# Altium schematic sheet 主控板Qiao.SchDoc
size A3
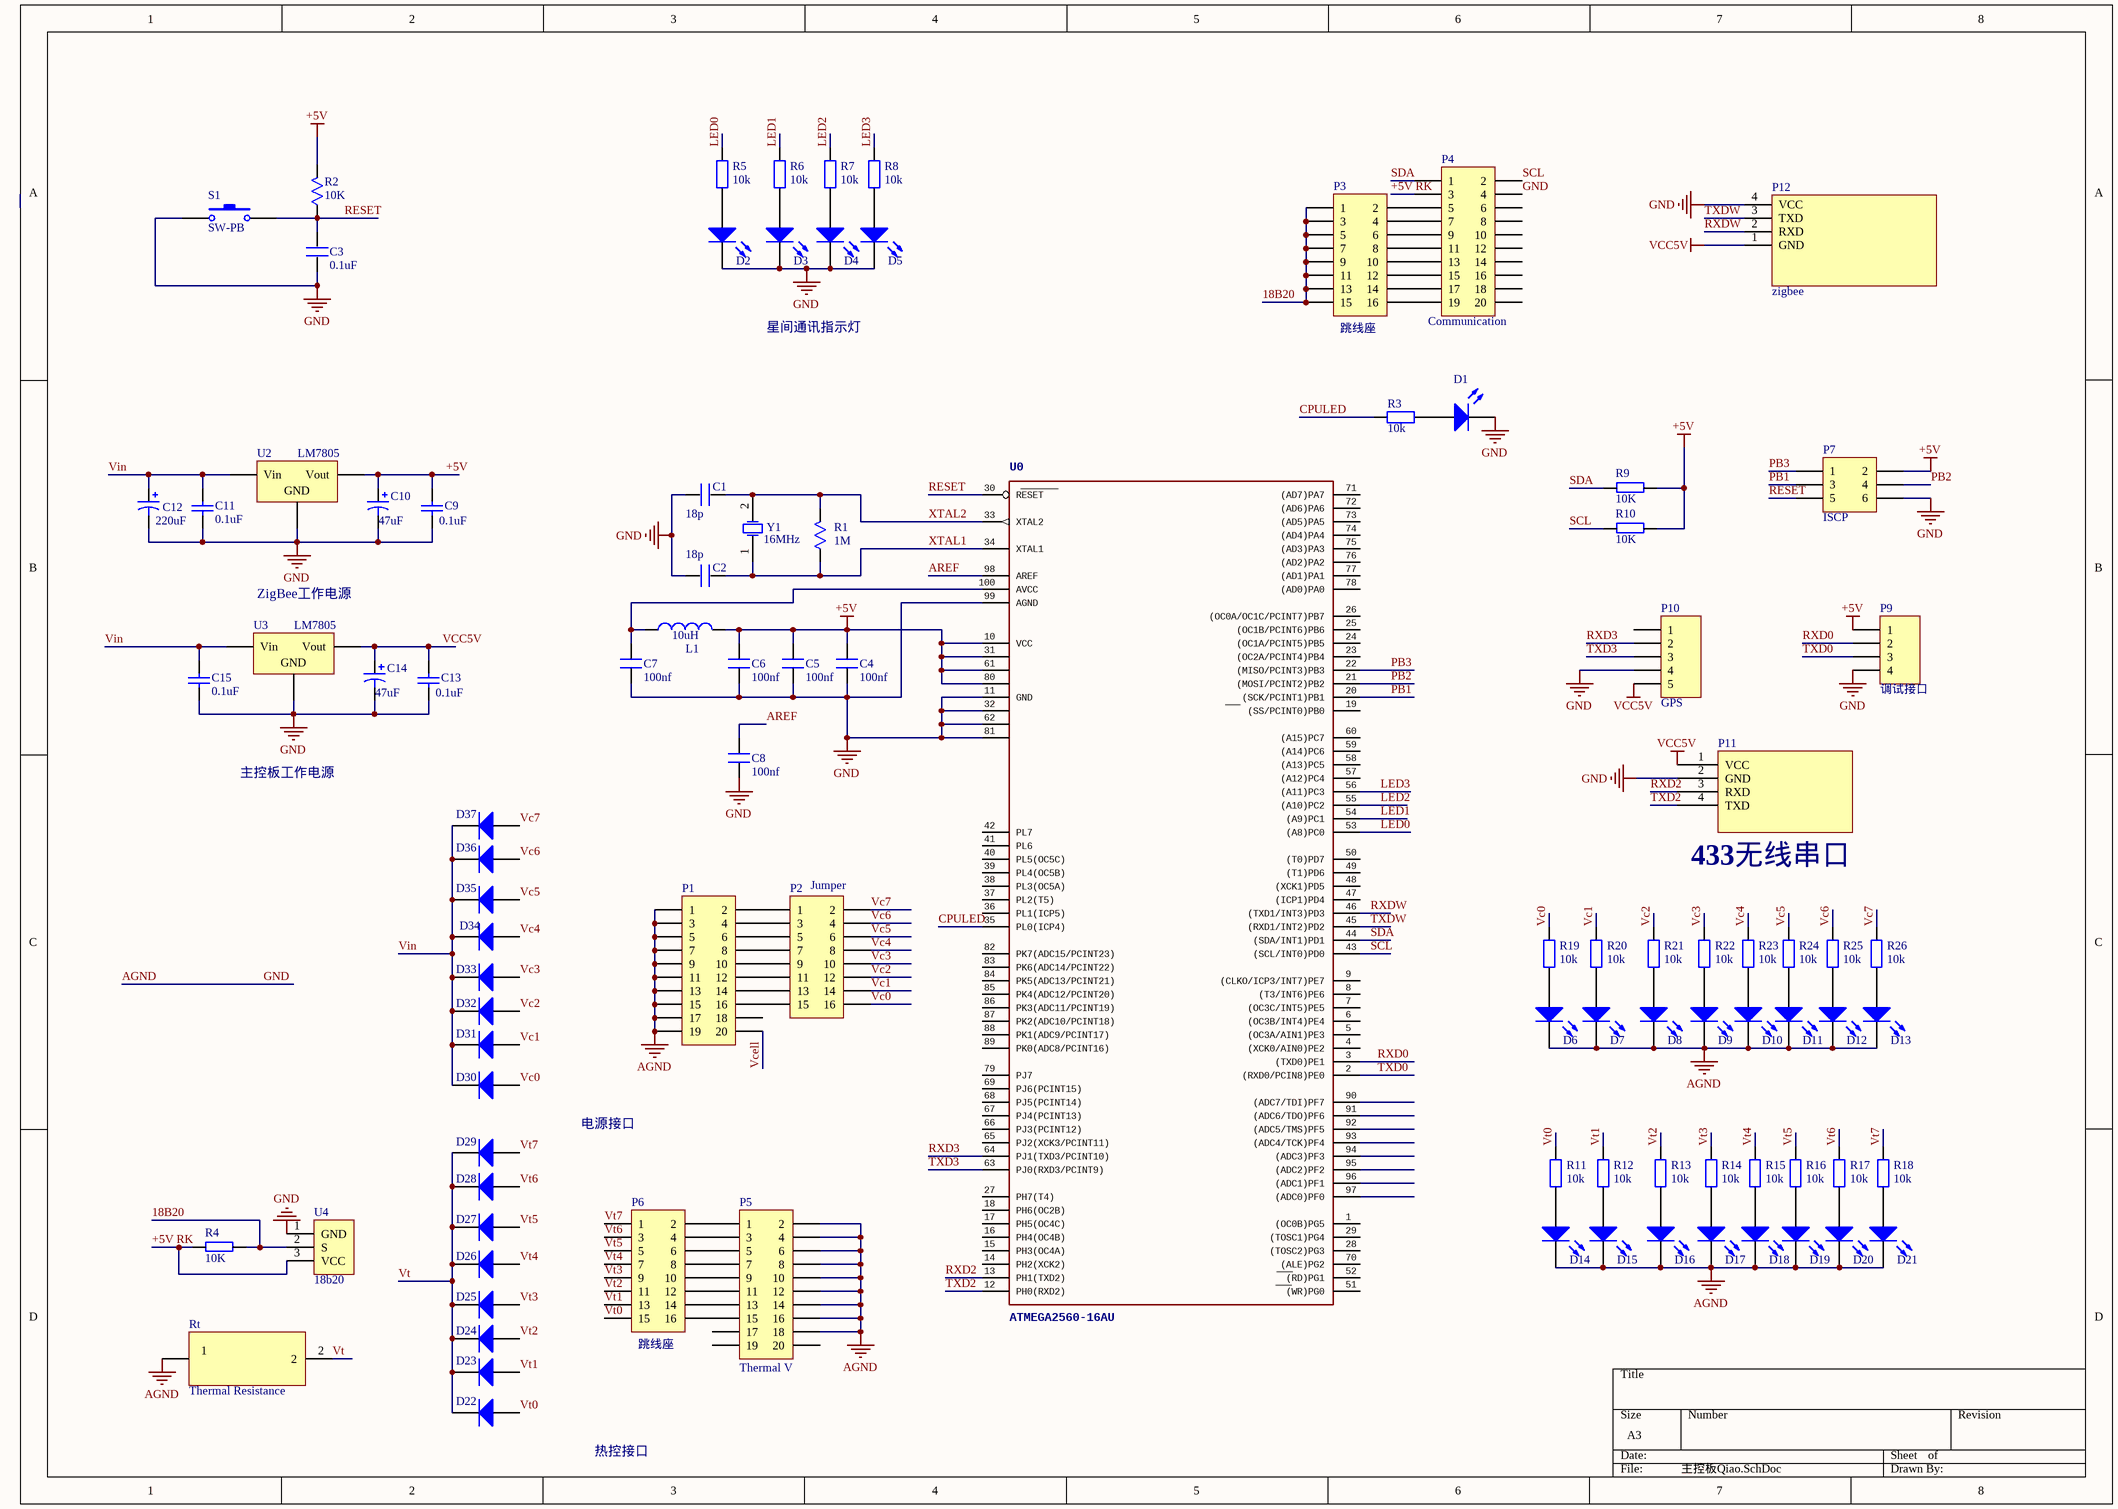
[diagram p0: 主控板Qiao.SchDoc]

## Parts
C1  18p  [CAPC3216M]
C2  18p  [CAPC3216M]
C3  0.1uF  [CAPC3216M]
C4  100nf  [CAPC3216M]
C5  100nf  [CAPC3216M]
C6  100nf  [CAPC3216M]
C7  100nf  [CAPC3216M]
C8  100nf  [CAPC3216M]
C9  0.1uf  [CAPC3216M]
C10  value 47uF  [25V47uF]  (hidden comment: 25V47uF)
C11  0.1uf  [CAPC3216M]
C12  value 220uF  [25V47uF]  (hidden comment: 50V220uF)
C13  0.1uf  [CAPC3216M]
C14  value 47uF  [25V47uF]  (hidden comment: 25V47uF)
C15  0.1uf  [CAPC3216M]
D1  LED  [DIPLED]  (value not drawn)
D2  LED  [LED]  (value not drawn)
D3  LED  [LED]  (value not drawn)
D4  LED  [LED]  (value not drawn)
D5  LED  [LED]  (value not drawn)
D6  LED  [LED]  (value not drawn)
D7  LED  [LED]  (value not drawn)
D8  LED  [LED]  (value not drawn)
D9  LED  [LED]  (value not drawn)
D10  LED  [LED]  (value not drawn)
D11  LED  [LED]  (value not drawn)
D12  LED  [LED]  (value not drawn)
D13  LED  [LED]  (value not drawn)
D14  LED  [LED]  (value not drawn)
D15  LED  [LED]  (value not drawn)
D16  LED  [LED]  (value not drawn)
D17  LED  [LED]  (value not drawn)
D18  LED  [LED]  (value not drawn)
D19  LED  [LED]  (value not drawn)
D20  LED  [LED]  (value not drawn)
D21  LED  [LED]  (value not drawn)
D22  1N4001  [SMB]  (value not drawn)
D23  1N4001  [SMB]  (value not drawn)
D24  1N4001  [SMB]  (value not drawn)
D25  1N4001  [SMB]  (value not drawn)
D26  1N4001  [SMB]  (value not drawn)
D27  1N4001  [SMB]  (value not drawn)
D28  1N4001  [SMB]  (value not drawn)
D29  1N4001  [SMB]  (value not drawn)
D30  1N4001  [SMB]  (value not drawn)
D31  1N4001  [SMB]  (value not drawn)
D32  1N4001  [SMB]  (value not drawn)
D33  1N4001  [SMB]  (value not drawn)
D34  1N4001  [SMB]  (value not drawn)
D35  1N4001  [SMB]  (value not drawn)
D36  1N4001  [SMB]  (value not drawn)
D37  1N4001  [SMB]  (value not drawn)
L1  value 10uH  [CAPC3216M]  (hidden comment: Inductor)
P1  Power Interface  [HDR2X10]  (value not drawn)
P2  Jumper  [HDR2X8]
P3  跳线座  [HDR2X8]
P4  Communication  [HDR2X10]
P5  Thermal V  [HDR2X10]
P6  跳线座  [HDR2X8]
P7  ISCP  [HDR2X3]
P9  调试接口  [HDR1X4]
P10  GPS  [GPS]
P11  433无线串口  [433PCB]
P12  zigbee  [ZigBee]
R1  1M  [RESC3216M]
R2  10K  [RESC3216M]
R3  10K  [RESC3216M]
R4  10K  [RESC3216M]
R5  10K  [RESC3216M]
R6  10K  [RESC3216M]
R7  10K  [RESC3216M]
R8  10K  [RESC3216M]
R9  10K  [RESC3216M]
R10  10K  [RESC3216M]
R11  10K  [RESC3216M]
R12  10K  [RESC3216M]
R13  10K  [RESC3216M]
R14  10K  [RESC3216M]
R15  10K  [RESC3216M]
R16  10K  [RESC3216M]
R17  10K  [RESC3216M]
R18  10K  [RESC3216M]
R19  10K  [RESC3216M]
R20  10K  [RESC3216M]
R21  10K  [RESC3216M]
R22  10K  [RESC3216M]
R23  10K  [RESC3216M]
R24  10K  [RESC3216M]
R25  10K  [RESC3216M]
R26  10K  [RESC3216M]
Rt  Thermal Resistance  [Thermal Res]
S1  SW-PB  [PUSH BUTTON 6x6]
U0  ATMEGA2560-16AU  [TQFP100]
U2  LM7805  [DPAK-3]
U3  LM7805  [DPAK-3]
U4  18b20  [TO92]
Y1  16MHz  [XTAL_US]

## Nets
+5V: C4.2 C5.2 C6.2 C9.2 C10.1 L1.2 P7.2 P9.1 R2.2 R9.1 R10.1 U0.10(VCC) U0.31(VCC1) U0.61(VCC2) U0.80(VCC3) U2.3(Vout)
AGND: C1.1 C2.1 C3.1 C4.1 C5.1 C6.1 C7.1 C8.1 C9.1 C10.2 C11.1 C12.2 C13.1 C14.2 C15.1 D1.2(K) D2.2(K) D3.2(K) D4.2(K) D5.2(K) D6.2(K) D7.2(K) D8.2(K) D9.2(K) D10.2(K) D11.2(K) D12.2(K) D13.2(K) D14.2(K) D15.2(K) D16.2(K) D17.2(K) D18.2(K) D19.2(K) D20.2(K) D21.2(K) P1.1 P1.3 P1.5 P1.7 P1.9 P1.11 P1.13 P1.15 P1.17 P1.19 P4.4 P5.2 P5.4 P5.6 P5.8 P5.10 P5.12 P5.14 P5.16 P5.18 P7.6 P9.4 P10.4 P11.2(GND) P12.4(VCC) Rt.1 S1.1 U0.11(GND) U0.32(GND1) U0.62(GND2) U0.81(GND3) U0.99(AGND) U2.2(GND) U3.2(GND) U4.1(GND)  [also labelled GND]
VCC5V: C13.2 C14.1 P10.5 P11.1(VCC) P12.1(GND) U3.3(Vout)
18B20: P3.1 P3.3 P3.5 P3.7 P3.9 P3.11 P3.13 P3.15 R4.1 U4.2(S)
+5V RK: P4.3 R4.2 U4.3(VCC)
AREF: C8.2 U0.98(AREF)
CPULED: R3.2 U0.35(PL0(ICP4))
LED0: R5.2 U0.53((A8)PC0)
LED1: R6.2 U0.54((A9)PC1)
LED2: R7.2 U0.55((A10)PC2)
LED3: R8.2 U0.56((A11)PC3)
PB1: P7.3 U0.20((SCK/PCINT1)PB1)
PB2: P7.4 U0.21((MOSI/PCINT2)PB2)
PB3: P7.1 U0.22((MISO/PCINT3)PB3)
RESET: C3.2 P7.5 R2.1 S1.2 U0.30(RESET)
RXD0: P9.2 U0.3((TXD0)PE1)
RXD2: P11.3(RXD) U0.13(PH1(TXD2))
RXD3: P10.2 U0.64(PJ1(TXD3/PCINT10))
RXDW: P12.2(RXD) U0.46((TXD1/INT3)PD3)
SCL: P4.2 R10.2 U0.43((SCL/INT0)PD0)
SDA: P4.1 R9.2 U0.44((SDA/INT1)PD1)
TXD0: P9.3 U0.2((RXD0/PCIN8)PE0)
TXD2: P11.4(TXD) U0.12(PH0(RXD2))
TXD3: P10.3 U0.63(PJ0(RXD3/PCINT9))
TXDW: P12.3(TXD) U0.45((RXD1/INT2)PD2)
Vc0: D30.1(A) P2.16 R19.2
Vc1: D31.1(A) P2.14 R20.2
Vc2: D32.1(A) P2.12 R21.2
Vc3: D33.1(A) P2.10 R22.2
Vc4: D34.1(A) P2.8 R23.2
Vc5: D35.1(A) P2.6 R24.2
Vc6: D36.1(A) P2.4 R25.2
Vc7: D37.1(A) P2.2 R26.2
Vcell: P1.20
Vin: C11.2 C12.1 C15.2 D30.2(K) D31.2(K) D32.2(K) D33.2(K) D34.2(K) D35.2(K) D36.2(K) D37.2(K) U2.1(Vin) U3.1(Vin)
Vt: D22.2(K) D23.2(K) D24.2(K) D25.2(K) D26.2(K) D27.2(K) D28.2(K) D29.2(K) Rt.2
Vt0: D22.1(A) P6.15 R11.2
Vt1: D23.1(A) P6.13 R12.2
Vt2: D24.1(A) P6.11 R13.2
Vt3: D25.1(A) P6.9 R14.2
Vt4: D26.1(A) P6.7 R15.2
Vt5: D27.1(A) P6.5 R16.2
Vt6: D28.1(A) P6.3 R17.2
Vt7: D29.1(A) P6.1 R18.2
XTAL1: C2.2 R1.1 U0.34(XTAL1) Y1.1(OSC1)
XTAL2: C1.2 R1.2 U0.33(XTAL2) Y1.2(OSC2)
NetC7_2: C7.2 L1.1 U0.100(AVCC)
NetD1_1: D1.1(A) R3.1
NetD2_1: D2.1(A) R5.1
NetD3_1: D3.1(A) R6.1
NetD4_1: D4.1(A) R7.1
NetD5_1: D5.1(A) R8.1
NetD6_1: D6.1(A) R19.1
NetD7_1: D7.1(A) R20.1
NetD8_1: D8.1(A) R21.1
NetD9_1: D9.1(A) R22.1
NetD10_1: D10.1(A) R23.1
NetD11_1: D11.1(A) R24.1
NetD12_1: D12.1(A) R25.1
NetD13_1: D13.1(A) R26.1
NetD14_1: D14.1(A) R11.1
NetD15_1: D15.1(A) R12.1
NetD16_1: D16.1(A) R13.1
NetD17_1: D17.1(A) R14.1
NetD18_1: D18.1(A) R15.1
NetD19_1: D19.1(A) R16.1
NetD20_1: D20.1(A) R17.1
NetD21_1: D21.1(A) R18.1
NetP1_2: P1.2 P2.1
NetP1_4: P1.4 P2.3
NetP1_6: P1.6 P2.5
NetP1_8: P1.8 P2.7
NetP1_10: P1.10 P2.9
NetP1_12: P1.12 P2.11
NetP1_14: P1.14 P2.13
NetP1_16: P1.16 P2.15
NetP3_2: P3.2 P4.5
NetP3_4: P3.4 P4.7
NetP3_6: P3.6 P4.9
NetP3_8: P3.8 P4.11
NetP3_10: P3.10 P4.13
NetP3_12: P3.12 P4.15
NetP3_14: P3.14 P4.17
NetP3_16: P3.16 P4.19
NetP5_1: P5.1 P6.2
NetP5_3: P5.3 P6.4
NetP5_5: P5.5 P6.6
NetP5_7: P5.7 P6.8
NetP5_9: P5.9 P6.10
NetP5_11: P5.11 P6.12
NetP5_13: P5.13 P6.14
NetP5_15: P5.15 P6.16

Not connected (* = marked no-connect by the designer): P1 18; P4 6 8 10 12 14 16 18 20; P5 17 19 20; P10 1; U0 1((OC0B)PG5) 4((XCK0/AIN0)PE2) 5((OC3A/AIN1)PE3) 6((OC3B/INT4)PE4) 7((OC3C/INT5)PE5) 8((T3/INT6)PE6) 9((CLKO/ICP3/INT7)PE7) 14(PH2(XCK2)) 15(PH3(OC4A)) 16(PH4(OC4B)) 17(PH5(OC4C)) 18(PH6(OC2B)) 19((SS/PCINT0)PB0) 23((OC2A/PCINT4)PB4) 24((OC1A/PCINT5)PB5) 25((OC1B/PCINT6)PB6) 26((OC0A/OC1C/PCINT7)PB7) 27(PH7(T4)) 28((TOSC2)PG3) 29((TOSC1)PG4) 36(PL1(ICP5)) 37(PL2(T5)) 38(PL3(OC5A)) 39(PL4(OC5B)) 40(PL5(OC5C)) 41(PL6) 42(PL7) 47((ICP1)PD4) 48((XCK1)PD5) 49((T1)PD6) 50((T0)PD7) 51((WR)PG0) 52((RD)PG1) 57((A12)PC4) 58((A13)PC5) 59((A14)PC6) 60((A15)PC7) 65(PJ2(XCK3/PCINT11)) 66(PJ3(PCINT12)) 67(PJ4(PCINT13)) 68(PJ5(PCINT14)) 69(PJ6(PCINT15)) 70((ALE)PG2) 71((AD7)PA7) 72((AD6)PA6) 73((AD5)PA5) 74((AD4)PA4) 75((AD3)PA3) 76((AD2)PA2) 77((AD1)PA1) 78((AD0)PA0) 79(PJ7) 82(PK7(ADC15/PCINT23)) 83(PK6(ADC14/PCINT22)) 84(PK5(ADC13/PCINT21)) 85(PK4(ADC12/PCINT20)) 86(PK3(ADC11/PCINT19)) 87(PK2(ADC10/PCINT18)) 88(PK1(ADC9/PCINT17)) 89(PK0(ADC8/PCINT16)) 90((ADC7/TDI)PF7) 91((ADC6/TDO)PF6) 92((ADC5/TMS)PF5) 93((ADC4/TCK)PF4) 94((ADC3)PF3) 95((ADC2)PF2) 96((ADC1)PF1) 97((ADC0)PF0)

## Notes on the sheet
- 星间通讯指示灯
- (near U3) ZigBee工作电源
- 主控板工作电源
- 电源接口
- 热控接口

## Library data of the parts
C1 C2 = C_1
C3 = C_3
C4-C8 = C
C9 C13 = Cap Semi: Published: 8-Jun-2000; LatestRevisionDate: 17-Jul-2002; LatestRevisionNote: Re-released for DXP Platform.; PackageReference: C1206; Publisher: Altium Limited; Value: 0.1uF
C10 C12 C14 = Cap Pol3: 10uf; Published: 8-Jun-2000; LatestRevisionDate: 17-Jul-2002; LatestRevisionNote: Re-released for DXP Platform.; PackageReference: C0805; Publisher: Altium Limited
C11 C15 = Cap: Published: 8-Jun-2000; LatestRevisionDate: 17-Jul-2002; LatestRevisionNote: Re-released for DXP Platform.; Publisher: Altium Limited; Value: 0.1uF
D1-D21 = LED2: Typical RED, GREEN, YELLOW, AMBER GaAs LED; Published: 8-Jun-2000; LatestRevisionDate: 17-Jul-2002; LatestRevisionNote: Re-released for DXP Platform.; PackageDocument: Feb-2002; PackageReference: 3.2X1.6X1.1; Publisher: Altium Limited
D22-D37 = Diode 1N4001: 1 Amp General Purpose Rectifier; Published: 8-Jun-2000; LatestRevisionDate: 17-Jul-2002; LatestRevisionNote: Re-released for DXP Platform.; DatasheetVersion: 1998; PackageVersion: Aug-1999; PackageReference: DO-41; Publisher: Altium Limited; PackageDescription: Diode, Axial; Body 5.2 x 2.7 mm (LxDia. max), Lead Dia. 0.86 mm (max); Code_JEDEC: DO-204-AL; ComponentLink1Description: Manufacturer Link; ComponentLink1URL: http://www.fairchildsemi.com/; ComponentLink2Description: Datasheet; ComponentLink2URL: http://www.fairchildsemi.com/ds/1N%2F1N4001.pdf
L1 = Inductor: Code_IEC: 1005; Published: 8-Jun-2000; LatestRevisionDate: 29-May-2009; LatestRevisionNote: IPC-7351 Footprint Added.; PackageReference: 0402-A; Publisher: Altium Limited; PackageDescription: Chip Inductor; Code_JEITA: 0402
P1 P4 P5 = Header 10X2: Header, 10-Pin, Dual row; LatestRevisionDate: 17-Jul-2002; LatestRevisionNote: Re-released for DXP Platform.; Publisher: Altium Limited
P2 P3 P6 = Header 8X2: Header, 8-Pin, Dual row; LatestRevisionDate: 17-Jul-2002; LatestRevisionNote: Re-released for DXP Platform.; Publisher: Altium Limited
P7 = Header 3X2: Header, 3-Pin, Dual row; LatestRevisionDate: 17-Jul-2002; LatestRevisionNote: Re-released for DXP Platform.; Publisher: Altium Limited
P9 = Header 4: Header, 4-Pin; LatestRevisionDate: 17-Jul-2002; LatestRevisionNote: Re-released for DXP Platform.; Publisher: Altium Limited
P10 = Header 5: Header, 5-Pin; LatestRevisionDate: 17-Jul-2002; LatestRevisionNote: Re-released for DXP Platform.; Publisher: Altium Limited
R1 R2 = RES
R3 R5-R8 R11-R26 = Res2: 5.1k; Published: 8-Jun-2000; LatestRevisionDate: 17-Jul-2002; LatestRevisionNote: Re-released for DXP Platform.; PackageReference: AXIAL-0.4; Publisher: Altium Limited; Value: 10k
R4 R9 R10 = R
Rt = ThermalResistance
S1 = SW-PB: Switch; Published: 24-Mar-1999; LatestRevisionDate: 17-Jul-2002; LatestRevisionNote: Re-released for DXP Platform.; PackageReference: SPST-2; Publisher: Altium Limited; PackageDescription: Switch; 2 Leads
U0 = ATMEGA2560AU: <b>MICROCONTROLLER</b><p> / 64/128/256 Kbytes FLASH<p> / 4 Kbytes EEPROM<p> / 8 Kbytes SRAM<p> / 86 General Purpose I/O pins<p> / 12-channels16-bit PWM<p> / 4 x Serial USARTs<p> / 16-channels 10-bit A/D<p>
U2 U3 = Volt Reg: Voltage Regulator; Published: 24-Mar-1999; LatestRevisionDate: 29-May-2009; LatestRevisionNote: IPC-7351 Footprint Added.; PackageReference: D2PAK; Publisher: Altium Limited; PackageDescription: 3-Pin Transistor Outline Package 2.54 mm Pitch, 15.1 mm Lead Span
Y1 = XTAL: Crystal Oscillator; Published: 8-Jun-2000; LatestRevisionDate: 17-Jul-2002; LatestRevisionNote: Re-released for DXP Platform.; Publisher: Altium Limited